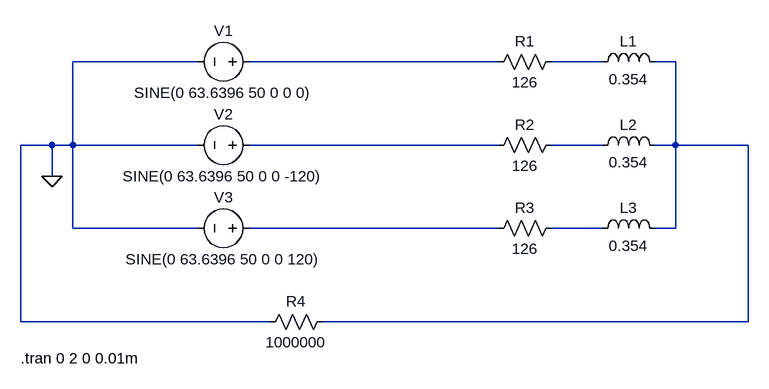
[diagram p0: schematic Draft1.asc]
Draft1.asc, the LTspice schematic file:
Version 4.1
SHEET 1 880 680
WIRE 16 112 -176 112
WIRE 480 112 96 112
WIRE 640 112 560 112
WIRE 752 112 720 112
WIRE -208 240 -256 240
WIRE -176 240 -176 112
WIRE -176 240 -208 240
WIRE 16 240 -176 240
WIRE 480 240 96 240
WIRE 640 240 560 240
WIRE 752 240 752 112
WIRE 752 240 720 240
WIRE 864 240 752 240
WIRE -208 288 -208 240
WIRE -176 368 -176 240
WIRE 16 368 -176 368
WIRE 480 368 96 368
WIRE 640 368 560 368
WIRE 752 368 752 240
WIRE 752 368 720 368
WIRE -256 512 -256 240
WIRE 128 512 -256 512
WIRE 864 512 864 240
WIRE 864 512 208 512
FLAG -208 288 0
SYMBOL voltage 112 112 R90
WINDOW 0 -32 56 VBottom 2
WINDOW 3 32 56 VTop 2
WINDOW 123 0 0 Left 0
WINDOW 39 0 0 Left 0
SYMATTR InstName V1
SYMATTR Value SINE(0 63.6396 50 0 0 0)
SYMBOL voltage 112 240 R90
WINDOW 0 -32 56 VBottom 2
WINDOW 3 32 56 VTop 2
WINDOW 123 0 0 Left 0
WINDOW 39 0 0 Left 0
SYMATTR InstName V2
SYMATTR Value SINE(0 63.6396 50 0 0 -120)
SYMBOL voltage 112 368 R90
WINDOW 0 -32 56 VBottom 2
WINDOW 3 32 56 VTop 2
WINDOW 123 0 0 Left 0
WINDOW 39 0 0 Left 0
SYMATTR InstName V3
SYMATTR Value SINE(0 63.6396 50 0 0 120)
SYMBOL res 576 96 R90
WINDOW 0 0 56 VBottom 2
WINDOW 3 32 56 VTop 2
SYMATTR InstName R1
SYMATTR Value 126
SYMBOL res 576 224 R90
WINDOW 0 0 56 VBottom 2
WINDOW 3 32 56 VTop 2
SYMATTR InstName R2
SYMATTR Value 126
SYMBOL res 576 352 R90
WINDOW 0 0 56 VBottom 2
WINDOW 3 32 56 VTop 2
SYMATTR InstName R3
SYMATTR Value 126
SYMBOL ind 624 128 R270
WINDOW 0 32 56 VTop 2
WINDOW 3 5 56 VBottom 2
SYMATTR InstName L1
SYMATTR Value 0.354
SYMATTR SpiceLine Rser=0
SYMBOL ind 624 256 R270
WINDOW 0 32 56 VTop 2
WINDOW 3 5 56 VBottom 2
SYMATTR InstName L2
SYMATTR Value 0.354
SYMATTR SpiceLine Rser=0
SYMBOL ind 624 384 R270
WINDOW 0 32 56 VTop 2
WINDOW 3 5 56 VBottom 2
SYMATTR InstName L3
SYMATTR Value 0.354
SYMATTR SpiceLine Rser=0
SYMBOL res 224 496 R90
WINDOW 0 0 56 VBottom 2
WINDOW 3 32 56 VTop 2
SYMATTR InstName R4
SYMATTR Value 1000000
TEXT -256 568 Left 2 !.tran 0 2 0 0.01m

The netlist it stands for:
* Draft1.asc
V1 N001 0 SINE(0 63.6396 50 0 0 0)
V2 N004 0 SINE(0 63.6396 50 0 0 -120)
V3 N006 0 SINE(0 63.6396 50 0 0 120)
R1 N002 N001 126
R2 N005 N004 126
R3 N007 N006 126
L1 N002 N003 0.354 Rser=0
L2 N005 N003 0.354 Rser=0
L3 N007 N003 0.354 Rser=0
R4 N003 0 1000000
.tran 0 2 0 0.01m
.backanno
.end